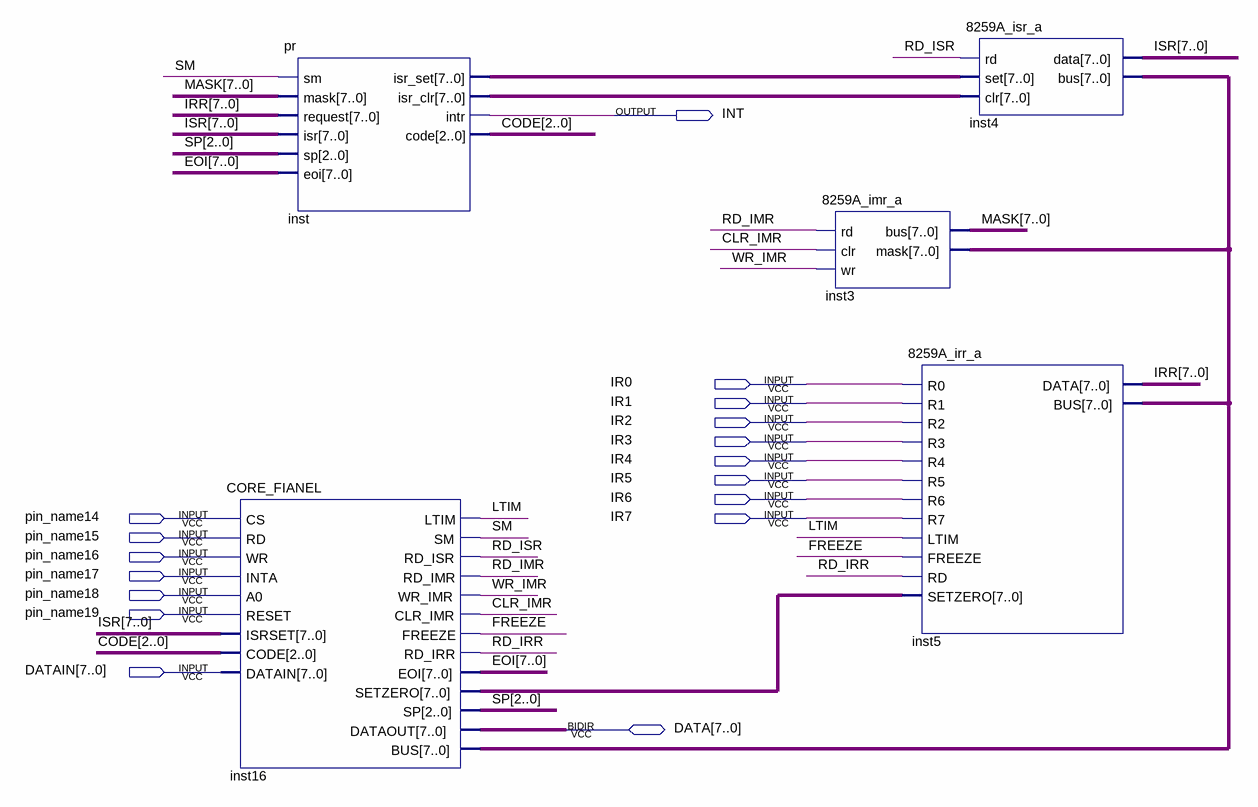
[diagram p0: schematic sheet]
// Quartus schematic 8259A.bdf as structural Verilog: 5 symbols, 17 pins
module \8259A  (
  input  IR0,
  input  IR1,
  input  IR2,
  input  IR3,
  input  IR4,
  input  IR5,
  input  IR6,
  input  pin_name14,
  input  IR7,
  input  pin_name15,
  input  pin_name16,
  input  pin_name17,
  input  pin_name18,
  input  pin_name19,
  input  [7:0] DATAIN,
  inout  [7:0] DATA,
  output INT
);

  wire CLR_IMR, FREEZE, LTIM, RD_IMR, RD_IRR, RD_ISR, SM, WR_IMR;
  wire [2:0] CODE, SP;
  wire [7:0] EOI, inst16_bus, inst16_setzero, inst_isr_clr, inst_isr_set, IRR, ISR, MASK;

  CORE_FIANEL inst16 (
    .CS(pin_name14), .RD(pin_name15), .WR(pin_name16), .INTA(pin_name17), .A0(pin_name18),
    .RESET(pin_name19), .ISRSET(ISR), .CODE(CODE), .DATAIN(DATAIN), .LTIM(LTIM), .SM(SM), .RD_ISR(RD_ISR),
    .RD_IMR(RD_IMR), .WR_IMR(WR_IMR), .CLR_IMR(CLR_IMR), .FREEZE(FREEZE), .RD_IRR(RD_IRR), .EOI(EOI),
    .SETZERO(inst16_setzero), .SP(SP), .DATAOUT(DATA), .BUS(inst16_bus));
  pr inst (
    .sm(SM), .mask(MASK), .request(IRR), .isr(ISR), .sp(SP), .eoi(EOI), .isr_set(inst_isr_set),
    .isr_clr(inst_isr_clr), .intr(INT), .code(CODE));
  \8259A_imr_a  inst3 (.rd(RD_IMR), .clr(CLR_IMR), .wr(WR_IMR), .mask(inst16_bus), .bus(MASK));
  \8259A_irr_a  inst5 (
    .R0(IR0), .R1(IR1), .R2(IR2), .R3(IR3), .R4(IR4), .R5(IR5), .R6(IR6), .R7(IR7), .LTIM(LTIM),
    .FREEZE(FREEZE), .RD(RD_IRR), .SETZERO(inst16_setzero), .DATA(IRR), .BUS(inst16_bus));
  \8259A_isr_a  inst4 (.rd(RD_ISR), .set(inst_isr_set), .clr(inst_isr_clr), .data(ISR), .bus(inst16_bus));
endmodule
